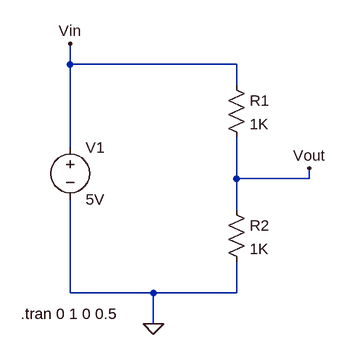
[diagram p0: schematic Potential_Divider.asc]
Potential_Divider.asc, the LTspice schematic file:
Version 4
SHEET 1 880 680
WIRE -32 0 -32 -32
WIRE 224 0 -32 0
WIRE 224 32 224 0
WIRE -32 128 -32 0
WIRE 224 176 224 112
WIRE 336 176 336 160
WIRE 336 176 224 176
WIRE 224 224 224 176
WIRE -32 352 -32 208
WIRE 96 352 -32 352
WIRE 224 352 224 304
WIRE 224 352 96 352
WIRE 96 400 96 352
FLAG 96 400 0
FLAG -32 -32 Vin
FLAG 336 160 Vout
SYMBOL res 208 16 R0
SYMATTR InstName R1
SYMATTR Value 1K
SYMBOL res 208 208 R0
SYMATTR InstName R2
SYMATTR Value 1K
SYMBOL voltage -32 112 R0
SYMATTR InstName V1
SYMATTR Value 5V
TEXT -108 384 Left 2 !.tran 0 1 0 0.5

The netlist it stands for:
* Potential_Divider.asc
R1 Vin Vout 1K
R2 Vout 0 1K
V1 Vin 0 5V
.tran 0 1 0 0.5
.backanno
.end